# Altium schematic sheet inverter.SchDoc
size A3; SheetNumber: 1; SheetTotal: 1
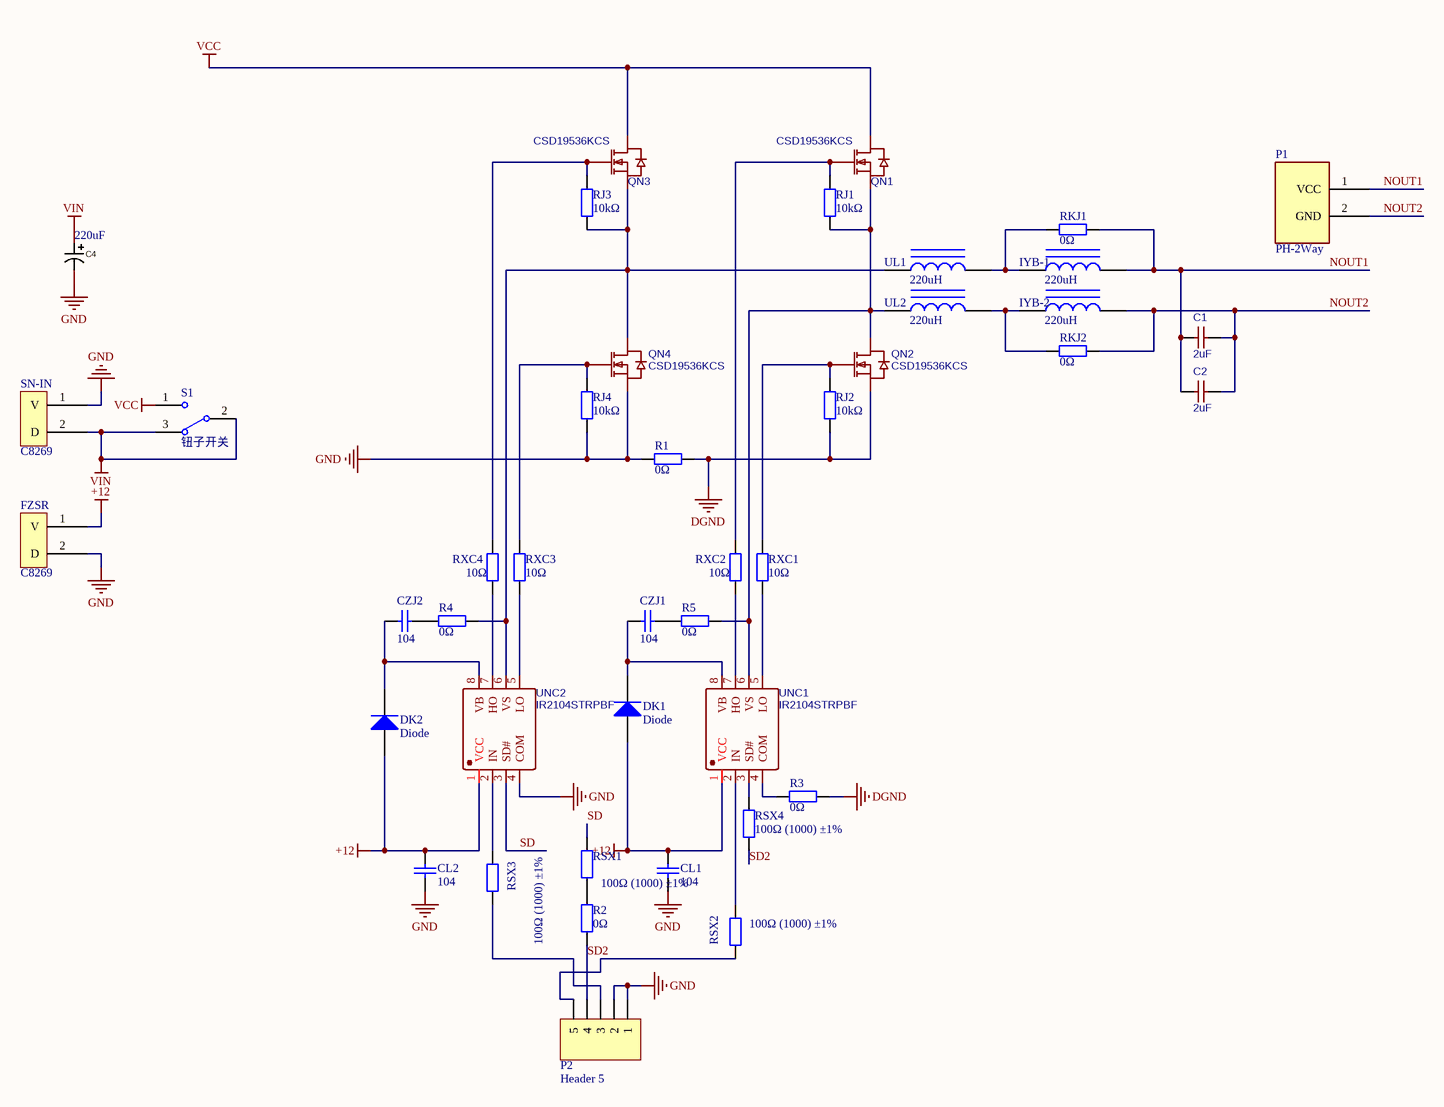
[diagram p0: inverter.SchDoc]

## Parts
C1  2uF  [CAP-TH_L23.0-W10.0-P20.00-D1.4]
C2  2uF  [CAP-TH_L23.0-W10.0-P20.00-D1.4]
C4  220uF  [CAP 5.0*10*12.5-H]
CL1  104  [0603_C]
CL2  104  [0603_C]
CZJ1  104  [0603_C]
CZJ2  104  [0603_C]
DK1  Diode  [SMA(DO-214AC)_S2]
DK2  Diode  [SMA(DO-214AC)_S2]
FZSR  C8269  [C8269]
IYB-1  220uH  [CDRH127]
IYB-2  220uH  [CDRH127]
P1  PH-2Way  [XH2.54-WS-2P]
P2  Header 5  [HDR2.54-WS-5P]
QN1  CSD19536KCS  [TO-220-3_L10.0-W4.5-P2.54-L]
QN2  CSD19536KCS  [TO-220-3_L10.0-W4.5-P2.54-L]
QN3  CSD19536KCS  [TO-220-3_L10.0-W4.5-P2.54-L]
QN4  CSD19536KCS  [TO-220-3_L10.0-W4.5-P2.54-L]
R1  0Ω  [1206_R]
R2  0Ω  [1206_R]
R3  0Ω  [1206_R]
R4  0Ω  [1206_R]
R5  0Ω  [1206_R]
RJ1  10kΩ  [0603_R]
RJ2  10kΩ  [0603_R]
RJ3  10kΩ  [0603_R]
RJ4  10kΩ  [0603_R]
RKJ1  0Ω  [1206_R]
RKJ2  0Ω  [1206_R]
RSX1  100Ω (1000) ±1%  [0805_R]
RSX2  100Ω (1000) ±1%  [0805_R]
RSX3  100Ω (1000) ±1%  [0805_R]
RSX4  100Ω (1000) ±1%  [0805_R]
RXC1  10Ω  [0603_R]
RXC2  10Ω  [0603_R]
RXC3  10Ω  [0603_R]
RXC4  10Ω  [0603_R]
S1  钮子开关  [SS-12D10]
SN-IN  C8269  [C8269]
UL1  220uH  [CDRH127]
UL2  220uH  [CDRH127]
UNC1  IR2104STRPBF  [SOIC-8_L4.9-W3.9-P1.27-LS6.0-BL]
UNC2  IR2104STRPBF  [SOIC-8_L4.9-W3.9-P1.27-LS6.0-BL]

## Nets
+12: CL1.2 CL2.2 DK1.1(A) DK2.1(A) FZSR.1(V) UNC1.1(VCC) UNC2.1(VCC)
DGND: QN2.3(S) R1.1 R3.2 RJ2.1
GND: C4.2 CL1.1 CL2.1 FZSR.2(D) P2.1 P2.2 QN4.3(S) R1.2 RJ4.1 SN-IN.1(V) UNC2.4(COM)
VCC: QN1.2(D) QN3.2(D) S1.1
VIN: C4.1 S1.2 S1.3 SN-IN.2(D)
NOUT1: C1.1 C2.1 IYB-1.2 P1.1(VCC) RKJ1.2
NOUT2: C1.2 C2.2 IYB-2.2 P1.2(GND) RKJ2.2
SD: RSX1.2 UNC2.3(SD#)
SD2: P2.4 R2.2 RSX4.1
NetCZJ1_1: CZJ1.1 DK1.2(K) UNC1.8(VB)
NetCZJ1_2: CZJ1.2 R5.1
NetCZJ2_1: CZJ2.1 DK2.2(K) UNC2.8(VB)
NetCZJ2_2: CZJ2.2 R4.1
NetIYB-1_1: IYB-1.1 RKJ1.1 UL1.2
NetIYB-2_1: IYB-2.1 RKJ2.1 UL2.2
NetP2_3: P2.3 RSX3.1
NetP2_5: P2.5 RSX2.1
NetQN1_1: QN1.1(G) RJ1.2 RXC2.2
NetQN1_3: QN1.3(S) QN2.2(D) R5.2 RJ1.1 UL2.1 UNC1.6(VS)
NetQN2_1: QN2.1(G) RJ2.2 RXC1.2
NetQN3_1: QN3.1(G) RJ3.2 RXC4.2
NetQN3_3: QN3.3(S) QN4.2(D) R4.2 RJ3.1 UL1.1 UNC2.6(VS)
NetQN4_1: QN4.1(G) RJ4.2 RXC3.2
NetR2_1: R2.1 RSX1.1
NetR3_1: R3.1 UNC1.4(COM)
NetRSX2_2: RSX2.2 UNC1.2(IN)
NetRSX3_2: RSX3.2 UNC2.2(IN)
NetRSX4_2: RSX4.2 UNC1.3(SD#)
NetRXC1_1: RXC1.1 UNC1.5(LO)
NetRXC2_1: RXC2.1 UNC1.7(HO)
NetRXC3_1: RXC3.1 UNC2.5(LO)
NetRXC4_1: RXC4.1 UNC2.7(HO)

## Library data of the parts
C1 C2 = 2uF-CBB: CBB，2uF电容; BOM_Manufacturer: SRD; BOM_Manufacturer Part: MPP205J4241119LC; nameAlias: Capacitance; BOM_Supplier: LCSC; BOM_Supplier Part: C93266; BOM_JLCPCB Part Class: Extended Part; spicePre: C; spiceSymbolName: MPP205J4241119LC
C4 = TH_Cap: 插件电容; Manufacturer: MAN YUE(万裕科技); Name: 100uF; Symbol: ULR107M1CE08TUX0CR; Add into BOM: yes; Type: 聚合物; Value: 100uF; Tolerance: ±20%; Rated Voltage: 16V; φD: 6.3mm; L: 8mm; Lifetime @ Temp: 2000hrs@105℃; Device: ULR107M1CE08TUX0CR; LCSC Part Name: 100uF ±20% 16V; Supplier Part: C2923568; Manufacturer Part: ULR107M1CE08TUX0CR; Supplier Footprint: 径向引线,6.3x8mm; JLCPCB Part Class: Extended Part; Datasheet: https://atta.szlcsc.com/upload/public/pdf/source/20211118/585B9CEDE9E08D4A86043C401C7B1F80.pdf; Supplier: LCSC; Convert to PCB: yes; Lead Spacing: 2.5mm; Ripple Current: -; Equivalent Series Resistance(ESR): -; Operating Temperature: -55℃~+105℃
CL1 CL2 CZJ1 CZJ2 = SMT_Cap: 贴片电容; ComponentLink1Description: 供应商链接; ComponentLink1URL: http://www.szlcsc.com/product/details_29010.html; Package: 0805; Supplier: LC; SuppliersPartNumber: C28260
DK1 DK2 = Diode: 通用二极管; ComponentLink1Description: 供应商链接; ComponentLink1URL: http://www.szlcsc.com/product/details_9093.html; Package: SOD-123; Supplier: LC; SuppliersPartNumber: C8598
IYB-1 IYB-2 UL1 UL2 = SMT_Iud_Power: 功率电感; ComponentLink1Description: 供应商链接; ComponentLink1URL: http://www.szlcsc.com/product/details_30010.html; Package: 0603; Supplier: LC; SuppliersPartNumber: C29258
P2 = Header 5: 排针
QN1-QN4 = CSD19536KCS: 实验室现有NMOS; BOM_Manufacturer: Texas Instruments; Contributor: LCSC; BOM_Supplier: LCSC; BOM_Supplier Part: C206030; BOM_Manufacturer Part: CSD19536KCS; BOM_JLCPCB Part Class: Extended Part; spicePre: Q; spiceSymbolName: CSD19536KCS
R1-R5 RJ1-RJ4 RKJ1 RKJ2 RXC1-RXC4 = SMT_Res: 贴片电阻; ComponentLink1Description: 供应商链接; ComponentLink1URL: http://www.szlcsc.com/product/details_23980.html; Package: 0603; Supplier: LC; SuppliersPartNumber: C23253
RSX1-RSX4 = 0805 100Ω (1000) 1%: 贴片电阻; ComponentLink1Description: 供应商链接; ComponentLink1URL: http://www.szlcsc.com/product/details_18096.html; Package: 0805; Supplier: LC; SuppliersPartNumber: C17408
S1 = 钮子开关: 大功率开关
UNC1 UNC2 = IR2104STRPBF: 贴片IR2104封装; BOM_Manufacturer: IR; spicePre: X; BOM_Supplier: LCSC; BOM_Manufacturer Part: IR2104STRPBF; BOM_Supplier Part: C2960; BOM_JLCPCB Part Class: Extended Part; spiceSymbolName: IR2104STRPBF